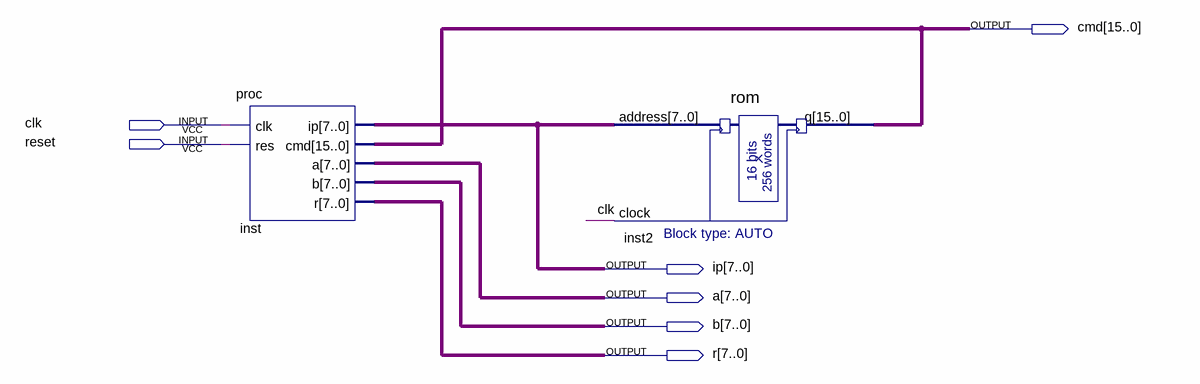
[diagram p0: schematic sheet]
// Quartus schematic uchebproc.bdf as structural Verilog: 2 symbols, 7 pins
module uchebproc (
  input  clk,
  input  reset,
  output [15:0] cmd,
  output [7:0] ip,
  output [7:0] a,
  output [7:0] b,
  output [7:0] r
);

  proc inst (.clk(clk), .res(reset), .ip(ip), .cmd(cmd), .a(a), .b(b), .r(r));
  rom inst2 (.address(ip), .clock(clk), .q(cmd));
endmodule
